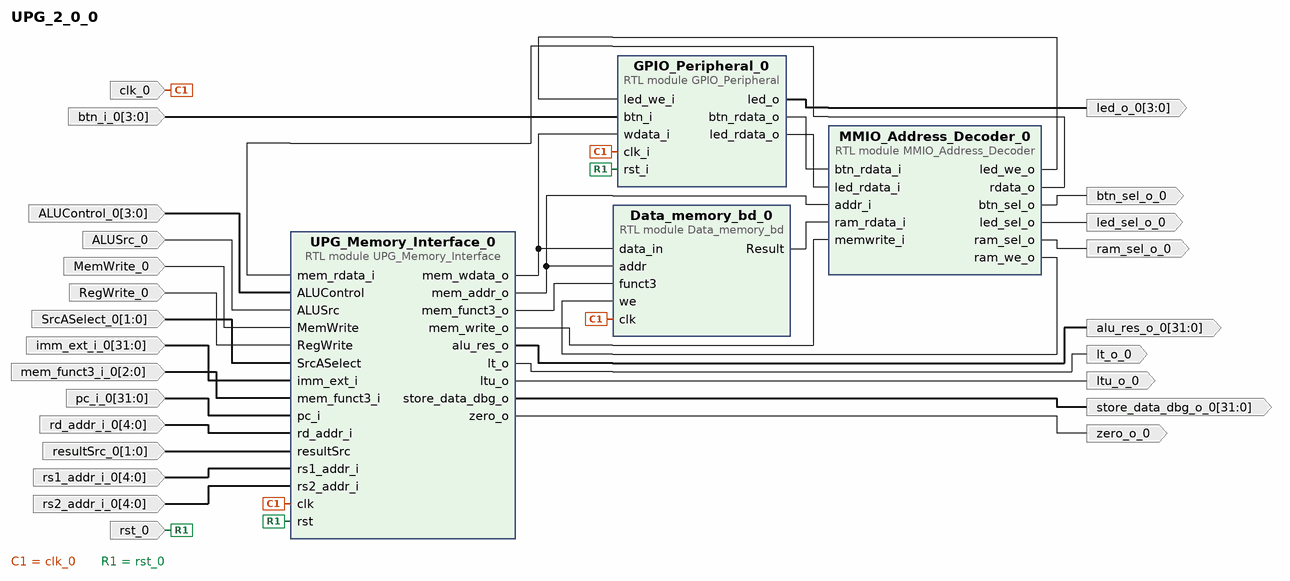
[diagram p0: block diagram of the top level]
# Vivado block design UPG_2_0_0, xc7a100tcsg324-1, Vivado 2025.1
create_bd_design UPG_2_0_0

create_bd_port -dir I MemWrite_0
create_bd_port -dir I ALUSrc_0
create_bd_port -dir I -from 1 -to 0 SrcASelect_0
create_bd_port -dir I -from 31 -to 0 pc_i_0
create_bd_port -dir I -from 4 -to 0 rs1_addr_i_0
create_bd_port -dir I RegWrite_0
create_bd_port -dir I -from 31 -to 0 imm_ext_i_0
create_bd_port -dir I -from 2 -to 0 mem_funct3_i_0
create_bd_port -dir I -from 4 -to 0 rs2_addr_i_0
create_bd_port -dir I -from 4 -to 0 rd_addr_i_0
create_bd_port -dir I -type clk clk_0
create_bd_port -dir I -from 3 -to 0 ALUControl_0
create_bd_port -dir I -from 1 -to 0 resultSrc_0
create_bd_port -dir I -type rst rst_0
create_bd_port -dir O lt_o_0
create_bd_port -dir O ltu_o_0
create_bd_port -dir O zero_o_0
create_bd_port -dir O -from 31 -to 0 alu_res_o_0
create_bd_port -dir O btn_sel_o_0
create_bd_port -dir O ram_sel_o_0
create_bd_port -dir O -from 31 -to 0 store_data_dbg_o_0
create_bd_port -dir O led_sel_o_0
create_bd_port -dir O -from 3 -to 0 led_o_0
create_bd_port -dir I -from 3 -to 0 btn_i_0

create_bd_cell -type module -reference Data_memory_bd Data_memory_bd_0
create_bd_cell -type module -reference UPG_Memory_Interface UPG_Memory_Interface_0
create_bd_cell -type module -reference MMIO_Address_Decoder MMIO_Address_Decoder_0
create_bd_cell -type module -reference GPIO_Peripheral GPIO_Peripheral_0

# ---- connections ----

connect_bd_net -net ALUControl_0_1 [get_bd_ports ALUControl_0] [get_bd_pins UPG_Memory_Interface_0/ALUControl]
connect_bd_net -net ALUSrc_0_1 [get_bd_ports ALUSrc_0] [get_bd_pins UPG_Memory_Interface_0/ALUSrc]
connect_bd_net [get_bd_pins Data_memory_bd_0/Result] [get_bd_pins MMIO_Address_Decoder_0/ram_rdata_i]
connect_bd_net [get_bd_pins GPIO_Peripheral_0/btn_rdata_o] [get_bd_pins MMIO_Address_Decoder_0/btn_rdata_i]
connect_bd_net [get_bd_pins GPIO_Peripheral_0/led_o] [get_bd_ports led_o_0]
connect_bd_net [get_bd_pins GPIO_Peripheral_0/led_rdata_o] [get_bd_pins MMIO_Address_Decoder_0/led_rdata_i]
connect_bd_net [get_bd_pins MMIO_Address_Decoder_0/btn_sel_o] [get_bd_ports btn_sel_o_0]
connect_bd_net [get_bd_pins MMIO_Address_Decoder_0/led_sel_o] [get_bd_ports led_sel_o_0]
connect_bd_net [get_bd_pins MMIO_Address_Decoder_0/led_we_o] [get_bd_pins GPIO_Peripheral_0/led_we_i]
connect_bd_net [get_bd_pins MMIO_Address_Decoder_0/ram_sel_o] [get_bd_ports ram_sel_o_0]
connect_bd_net [get_bd_pins MMIO_Address_Decoder_0/ram_we_o] [get_bd_pins Data_memory_bd_0/we]
connect_bd_net [get_bd_pins MMIO_Address_Decoder_0/rdata_o] [get_bd_pins UPG_Memory_Interface_0/mem_rdata_i]
connect_bd_net -net MemWrite_0_1 [get_bd_ports MemWrite_0] [get_bd_pins UPG_Memory_Interface_0/MemWrite]
connect_bd_net -net RegWrite_0_1 [get_bd_ports RegWrite_0] [get_bd_pins UPG_Memory_Interface_0/RegWrite]
connect_bd_net -net SrcASelect_0_1 [get_bd_ports SrcASelect_0] [get_bd_pins UPG_Memory_Interface_0/SrcASelect]
connect_bd_net [get_bd_pins UPG_Memory_Interface_0/alu_res_o] [get_bd_ports alu_res_o_0]
connect_bd_net [get_bd_pins UPG_Memory_Interface_0/lt_o] [get_bd_ports lt_o_0]
connect_bd_net [get_bd_pins UPG_Memory_Interface_0/ltu_o] [get_bd_ports ltu_o_0]
connect_bd_net [get_bd_pins UPG_Memory_Interface_0/mem_addr_o] [get_bd_pins MMIO_Address_Decoder_0/addr_i] [get_bd_pins Data_memory_bd_0/addr]
connect_bd_net [get_bd_pins UPG_Memory_Interface_0/mem_funct3_o] [get_bd_pins Data_memory_bd_0/funct3]
connect_bd_net [get_bd_pins UPG_Memory_Interface_0/mem_wdata_o] [get_bd_pins Data_memory_bd_0/data_in] [get_bd_pins GPIO_Peripheral_0/wdata_i]
connect_bd_net [get_bd_pins UPG_Memory_Interface_0/mem_write_o] [get_bd_pins MMIO_Address_Decoder_0/memwrite_i]
connect_bd_net [get_bd_pins UPG_Memory_Interface_0/store_data_dbg_o] [get_bd_ports store_data_dbg_o_0]
connect_bd_net [get_bd_pins UPG_Memory_Interface_0/zero_o] [get_bd_ports zero_o_0]
connect_bd_net -net btn_i_0_1 [get_bd_ports btn_i_0] [get_bd_pins GPIO_Peripheral_0/btn_i]
connect_bd_net -net clk_0_1 [get_bd_ports clk_0] \
  [get_bd_pins UPG_Memory_Interface_0/clk] [get_bd_pins GPIO_Peripheral_0/clk_i] [get_bd_pins Data_memory_bd_0/clk]
connect_bd_net -net imm_ext_i_0_1 [get_bd_ports imm_ext_i_0] [get_bd_pins UPG_Memory_Interface_0/imm_ext_i]
connect_bd_net -net mem_funct3_i_0_1 [get_bd_ports mem_funct3_i_0] [get_bd_pins UPG_Memory_Interface_0/mem_funct3_i]
connect_bd_net -net pc_i_0_1 [get_bd_ports pc_i_0] [get_bd_pins UPG_Memory_Interface_0/pc_i]
connect_bd_net -net rd_addr_i_0_1 [get_bd_ports rd_addr_i_0] [get_bd_pins UPG_Memory_Interface_0/rd_addr_i]
connect_bd_net -net resultSrc_0_1 [get_bd_ports resultSrc_0] [get_bd_pins UPG_Memory_Interface_0/resultSrc]
connect_bd_net -net rs1_addr_i_0_1 [get_bd_ports rs1_addr_i_0] [get_bd_pins UPG_Memory_Interface_0/rs1_addr_i]
connect_bd_net -net rs2_addr_i_0_1 [get_bd_ports rs2_addr_i_0] [get_bd_pins UPG_Memory_Interface_0/rs2_addr_i]
connect_bd_net -net rst_0_1 [get_bd_ports rst_0] [get_bd_pins UPG_Memory_Interface_0/rst] [get_bd_pins GPIO_Peripheral_0/rst_i]

validate_bd_design
save_bd_design
